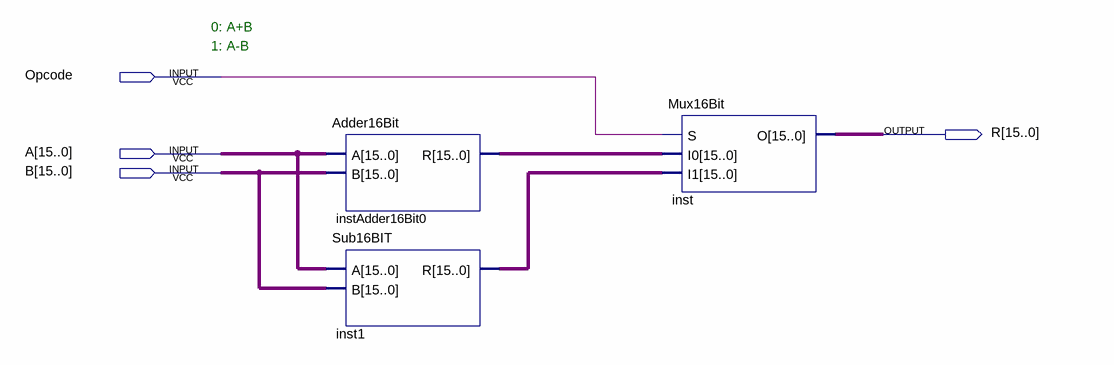
[diagram p0: schematic sheet]
// Quartus schematic AddSub16bit.bdf as structural Verilog: 3 symbols, 4 pins
module AddSub16bit (
  input  Opcode,
  input  [15:0] A,
  input  [15:0] B,
  output [15:0] R
);

  wire [15:0] inst1_r, instAdder16Bit0_r;

  Adder16Bit instAdder16Bit0 (.A(A), .B(B), .R(instAdder16Bit0_r));
  Sub16BIT inst1 (.A(A), .B(B), .R(inst1_r));
  Mux16Bit inst (.S(Opcode), .I0(instAdder16Bit0_r), .I1(inst1_r), .O(R));

  // Notes on the sheet:
  //   0: A+B
  //   1: A-B
endmodule
